# Altium schematic sheet MainInterface.SchDoc
size A4
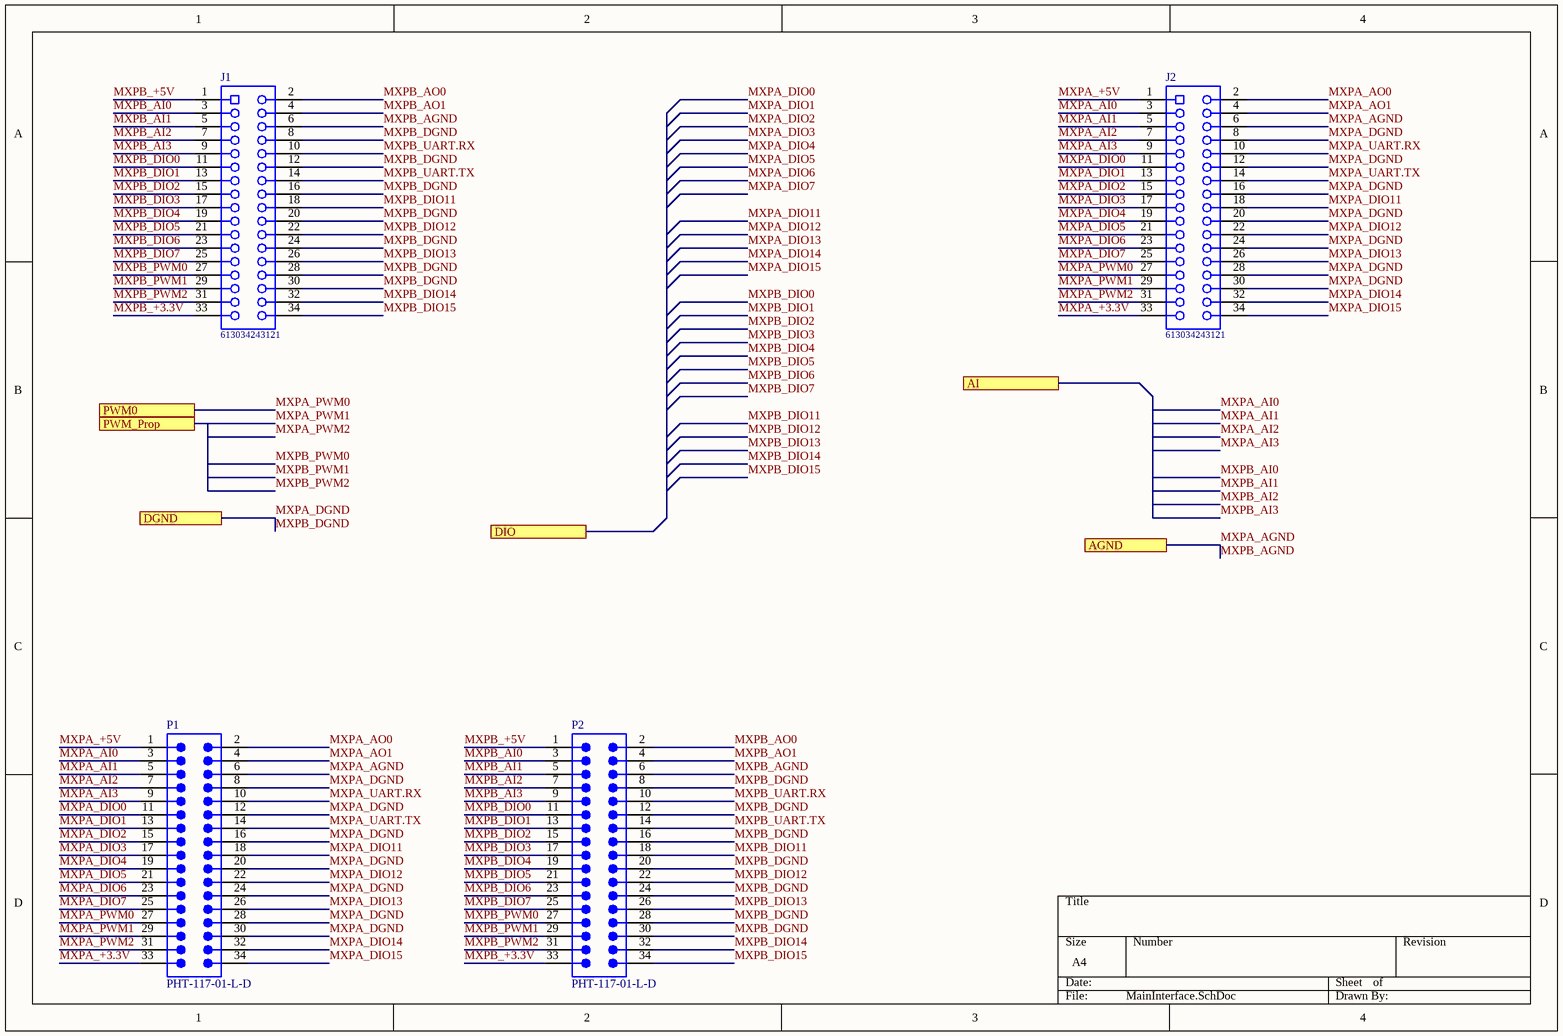
[diagram p0: MainInterface.SchDoc]

## Parts
J1  613034243121  [613034243121]
J2  613034243121  [613034243121]
P1  PHT-117-01-L-D  [SMTC-PHT-117-01-X-D]
P2  PHT-117-01-L-D  [SMTC-PHT-117-01-X-D]

## Ports
AGND, AI, DGND, DIO, PWM0, PWM_Prop

## Nets
MXPA_+3.3V: J2.33 P1.33
MXPA_+5V: J2.1 P1.1
MXPA_AGND: J1.6 J2.6 P1.6 P2.6 ; port AGND  [also labelled MXPB_AGND]
MXPA_AI0: J2.3 P1.3
MXPA_AI1: J2.5 P1.5
MXPA_AI2: J2.7 P1.7
MXPA_AI3: J2.9 P1.9
MXPA_AO0: J2.2 P1.2
MXPA_AO1: J2.4 P1.4
MXPA_DGND: J1.8 J1.12 J1.16 J1.20 J1.24 J1.28 J1.30 J2.8 J2.12 J2.16 J2.20 J2.24 J2.28 J2.30 P1.8 P1.12 P1.16 P1.20 P1.24 P1.28 P1.30 P2.8 P2.12 P2.16 P2.20 P2.24 P2.28 P2.30 ; port DGND  [also labelled MXPB_DGND]
MXPA_DIO0: J2.11 P1.11
MXPA_DIO1: J2.13 P1.13
MXPA_DIO2: J2.15 P1.15
MXPA_DIO3: J2.17 P1.17
MXPA_DIO4: J2.19 P1.19
MXPA_DIO5: J2.21 P1.21
MXPA_DIO6: J2.23 P1.23
MXPA_DIO7: J2.25 P1.25
MXPA_DIO11: J2.18 P1.18
MXPA_DIO12: J2.22 P1.22
MXPA_DIO13: J2.26 P1.26
MXPA_DIO14: J2.32 P1.32
MXPA_DIO15: J2.34 P1.34
MXPA_PWM0: J2.27 P1.27 ; port PWM0
MXPA_PWM1: J2.29 P1.29 ; port PWM_Prop
MXPA_PWM2: J2.31 P1.31
MXPA_UART.RX: J2.10 P1.10
MXPA_UART.TX: J2.14 P1.14
MXPB_+3.3V: J1.33 P2.33
MXPB_+5V: J1.1 P2.1
MXPB_AI0: J1.3 P2.3
MXPB_AI1: J1.5 P2.5
MXPB_AI2: J1.7 P2.7
MXPB_AI3: J1.9 P2.9
MXPB_AO0: J1.2 P2.2
MXPB_AO1: J1.4 P2.4
MXPB_DIO0: J1.11 P2.11
MXPB_DIO1: J1.13 P2.13
MXPB_DIO2: J1.15 P2.15
MXPB_DIO3: J1.17 P2.17
MXPB_DIO4: J1.19 P2.19
MXPB_DIO5: J1.21 P2.21
MXPB_DIO6: J1.23 P2.23
MXPB_DIO7: J1.25 P2.25
MXPB_DIO11: J1.18 P2.18
MXPB_DIO12: J1.22 P2.22
MXPB_DIO13: J1.26 P2.26
MXPB_DIO14: J1.32 P2.32
MXPB_DIO15: J1.34 P2.34
MXPB_PWM0: J1.27 P2.27
MXPB_PWM1: J1.29 P2.29
MXPB_PWM2: J1.31 P2.31
MXPB_UART.RX: J1.10 P2.10
MXPB_UART.TX: J1.14 P2.14

## Library data of the parts
J1 J2 = CMP-1502-01447-1: THT Angled Socket Header WR-PHD, Pitch 2.54 mm, Dual Row, 34 pins; Manufacturer: Wurth Elektronik; Working Voltage: 250VAC; Pitch: 2.54mm; Contact Resistance: 20mOhm; Gender: Female; Pin Number: 34; Rated Current: 3A; Withstanding Voltage: 500VAC; Datasheet URL: https://katalog.we-online.de/em/datasheet/6130xx243121.pdf; Part Number: 613034243121; Operating Temperature: -40to125degC; Package Reference: 613034243121; Row Number: Dual; Orientation: Angled; Manufacturer URL: http://www.we-online.de; Publisher: WurthElektronik; Packaging: Tray; Mounting Technology: THT
P1 P2 = CMP-1024-00200-1: Press Fit Header, Through-hole, Vertical, -55 to 125 degC, 2.54 mm Pitch, 34-Pin, Male, RoHS; Manufacturer: Samtec; Pitch: 2.54 mm; DatasheetVersion: F-214; PartNumber: PHT-117-01-L-D; ComponentLink2URL: http://www.samtec.com/documents/webfiles/pdf/pht.pdf; ComponentLink1URL: http://www.samtec.com; Orientation: Vertical; PackageDescription: .100 Press Fit Socket Assembly; ComponentLink3Description: Package Specification; PackageVersion: J, 9/2009; Mounting Technology: Through-hole; ComponentLink1Description: Manufacturer URL; RoHS: True; PackageReference: PHT-117-01-X-D; ComponentLink2Description: Datasheet; Temperature Range: -55 to 125 degC; ComponentLink3URL: http://www.samtec.com/documents/webfiles/cpdf/PHT-1XX-XX-X-X-XXX-MKT.pdf